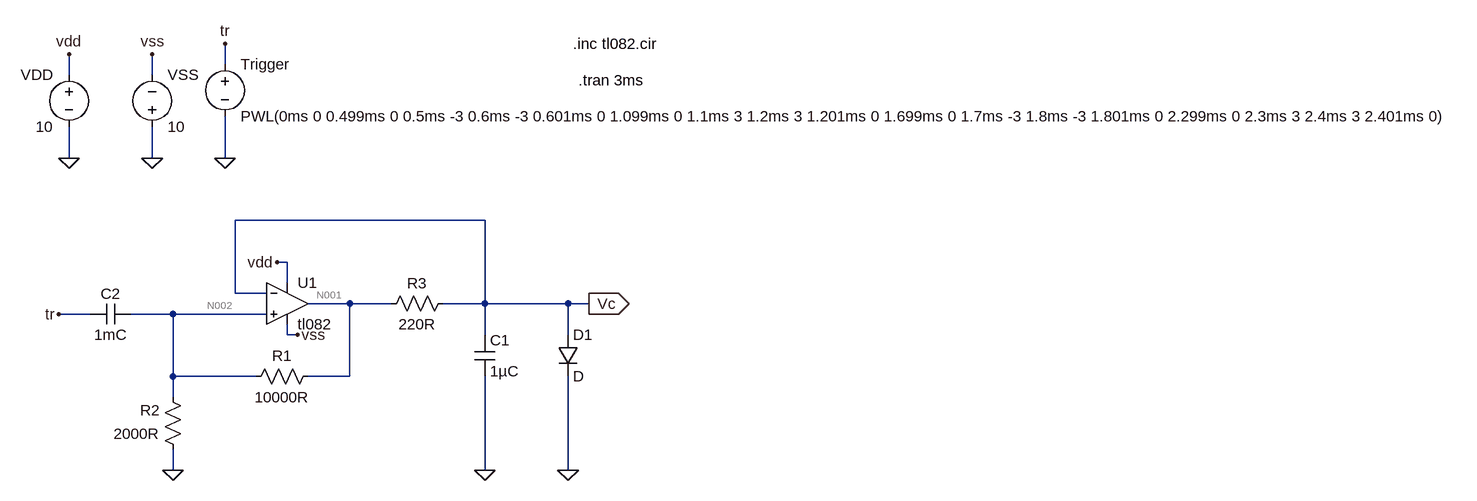
[diagram p0: schematic monostabile_kippstufe.asc]
monostabile_kippstufe.asc, the LTspice schematic file:
Version 4
SHEET 1 1808 680
WIRE -304 -208 -304 -240
WIRE -544 -192 -544 -224
WIRE -416 -192 -416 -224
WIRE -544 -64 -544 -112
WIRE -416 -64 -416 -112
WIRE -304 -64 -304 -128
WIRE 96 32 -288 32
WIRE -208 96 -224 96
WIRE -208 128 -208 96
WIRE -288 144 -288 32
WIRE -240 144 -288 144
WIRE -112 160 -176 160
WIRE -48 160 -112 160
WIRE 96 160 96 32
WIRE 96 160 32 160
WIRE 224 160 96 160
WIRE 256 160 224 160
WIRE -512 176 -560 176
WIRE -384 176 -448 176
WIRE -240 176 -384 176
WIRE -208 208 -208 192
WIRE -192 208 -208 208
WIRE 96 208 96 160
WIRE 224 208 224 160
WIRE -384 272 -384 176
WIRE -256 272 -384 272
WIRE -112 272 -112 160
WIRE -112 272 -176 272
WIRE -384 304 -384 272
WIRE -384 416 -384 384
WIRE 96 416 96 272
WIRE 224 416 224 272
FLAG -544 -64 0
FLAG -416 -64 0
FLAG -544 -224 vdd
FLAG -224 96 vdd
FLAG -416 -224 vss
FLAG -192 208 vss
FLAG -384 416 0
FLAG 96 416 0
FLAG 224 416 0
FLAG 256 160 Vc
IOPIN 256 160 Out
FLAG -304 -64 0
FLAG -304 -240 tr
FLAG -560 176 tr
SYMBOL voltage -544 -208 M0
SYMATTR InstName VDD
SYMATTR Value 10
SYMBOL voltage -416 -96 M180
WINDOW 0 24 96 Left 2
WINDOW 3 24 16 Left 2
SYMATTR InstName VSS
SYMATTR Value 10
SYMBOL Opamps\\opamp2 -208 96 R0
SYMATTR InstName U1
SYMATTR Value tl082
SYMBOL res -272 288 R270
WINDOW 0 32 56 VTop 2
WINDOW 3 0 56 VBottom 2
SYMATTR InstName R1
SYMATTR Value 10000R
SYMBOL res -368 400 R180
WINDOW 0 36 76 Left 2
WINDOW 3 36 40 Left 2
SYMATTR InstName R2
SYMATTR Value 2000R
SYMBOL res 48 144 R90
WINDOW 0 0 56 VBottom 2
WINDOW 3 32 56 VTop 2
SYMATTR InstName R3
SYMATTR Value 220R
SYMBOL cap 80 208 R0
SYMATTR InstName C1
SYMATTR Value 1µC
SYMBOL diode 208 208 R0
SYMATTR InstName D1
SYMBOL cap -448 160 R90
WINDOW 0 0 32 VBottom 2
WINDOW 3 32 32 VTop 2
SYMATTR InstName C2
SYMATTR Value 1mC
SYMBOL voltage -304 -224 R0
WINDOW 123 0 0 Left 0
WINDOW 39 0 0 Left 0
SYMATTR InstName Trigger
SYMATTR Value PWL(0ms 0 0.499ms 0 0.5ms -3 0.6ms -3 0.601ms 0 1.099ms 0 1.1ms 3 1.2ms 3 1.201ms 0 1.699ms 0 1.7ms -3 1.8ms -3 1.801ms 0 2.299ms 0 2.3ms 3 2.4ms 3 2.401ms 0)
TEXT 232 -240 Left 2 !.inc tl082.cir
TEXT 240 -184 Left 2 !.tran 3ms

The netlist it stands for:
* monostabile_kippstufe.asc
VDD vdd 0 10
VSS 0 vss 10
XU1 N002 Vc vdd vss N001 tl082  ; pins In+ In- V+ V- OUT
R1 N002 N001 10000R
R2 0 N002 2000R
R3 Vc N001 220R
C1 Vc 0 1µC
D1 Vc 0 D
C2 N002 tr 1mC
V§Trigger tr 0 PWL(0ms 0 0.499ms 0 0.5ms -3 0.6ms -3 0.601ms 0 1.099ms 0 1.1ms 3 1.2ms 3 1.201ms 0 1.699ms 0 1.7ms -3 1.8ms -3 1.801ms 0 2.299ms 0 2.3ms 3 2.4ms 3 2.401ms 0)
.model D D
.lib standard.dio
.inc tl082.cir
.tran 3ms
.backanno
.end

* Results of the author's LTspice run, read from the files saved beside the schematic
* Operating Point, zero values left out:
*   V(vdd) = 10 V
*   V(vss) = -10 V
*   V(n001) = 6.268 V
*   V(vc) = 738.5 mV
*   V(n002) = 1.045 V
*   I(D1) = 25.14 mA
*   I(R3) = -25.14 mA
*   I(R2) = -522.4 µA
*   I(R1) = -522.4 µA
*   I(Vss) = -9.527 mA
*   I(Vdd) = -9.528 mA
*   Ix(u1:1) = 41.44 pA
*   Ix(u1:2) = 40.49 pA
*   Ix(u1:3) = 9.528 mA
*   Ix(u1:4) = -9.527 mA
*   Ix(u1:5) = -25.66 mA
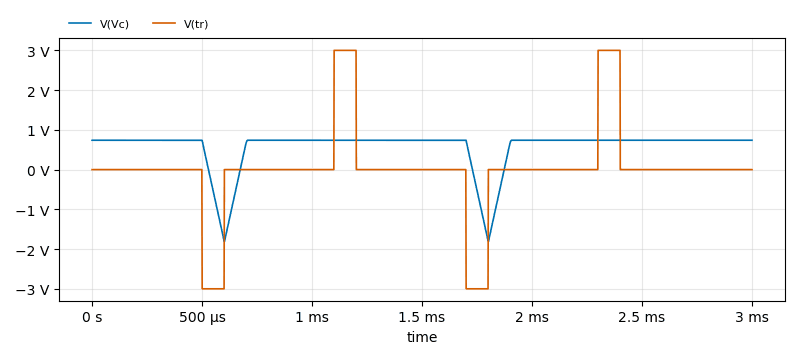
[diagram p1: Transient Analysis of monostabile_kippstufe.asc, plotted from the saved traces]
* Transient Analysis, 1 run:
*   V(Vc): min -1.813 V, max 738.8 mV, average 565.3 mV, rms 772.7 mV, last 738.5 mV
*   V(tr): min -3 V, max 3 V, average 0 V, rms 1.099 V, last 0 V